# EAGLE board 2_1 (EAGLE 5.10)
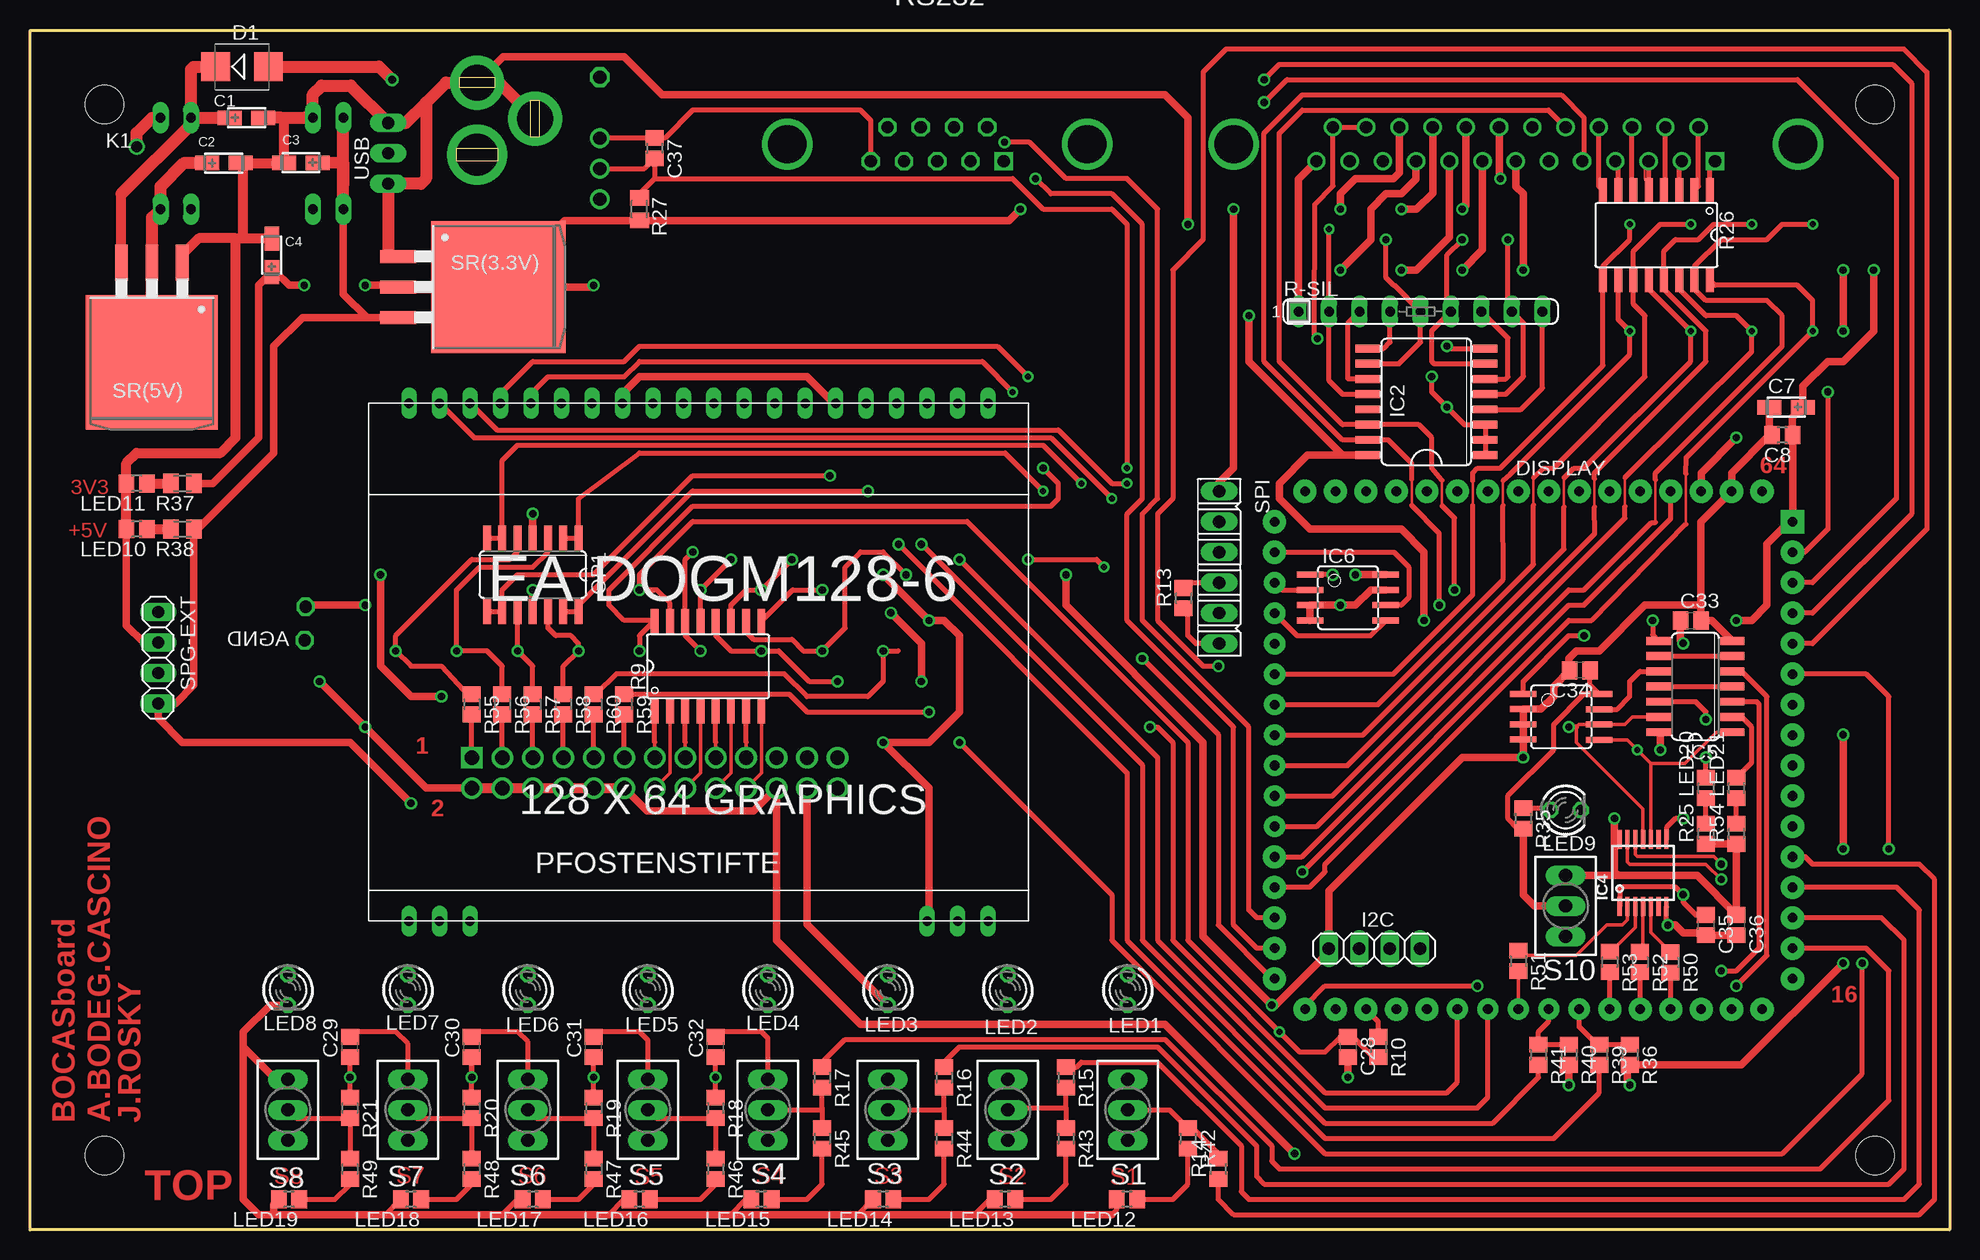
[diagram p2: board, top side]
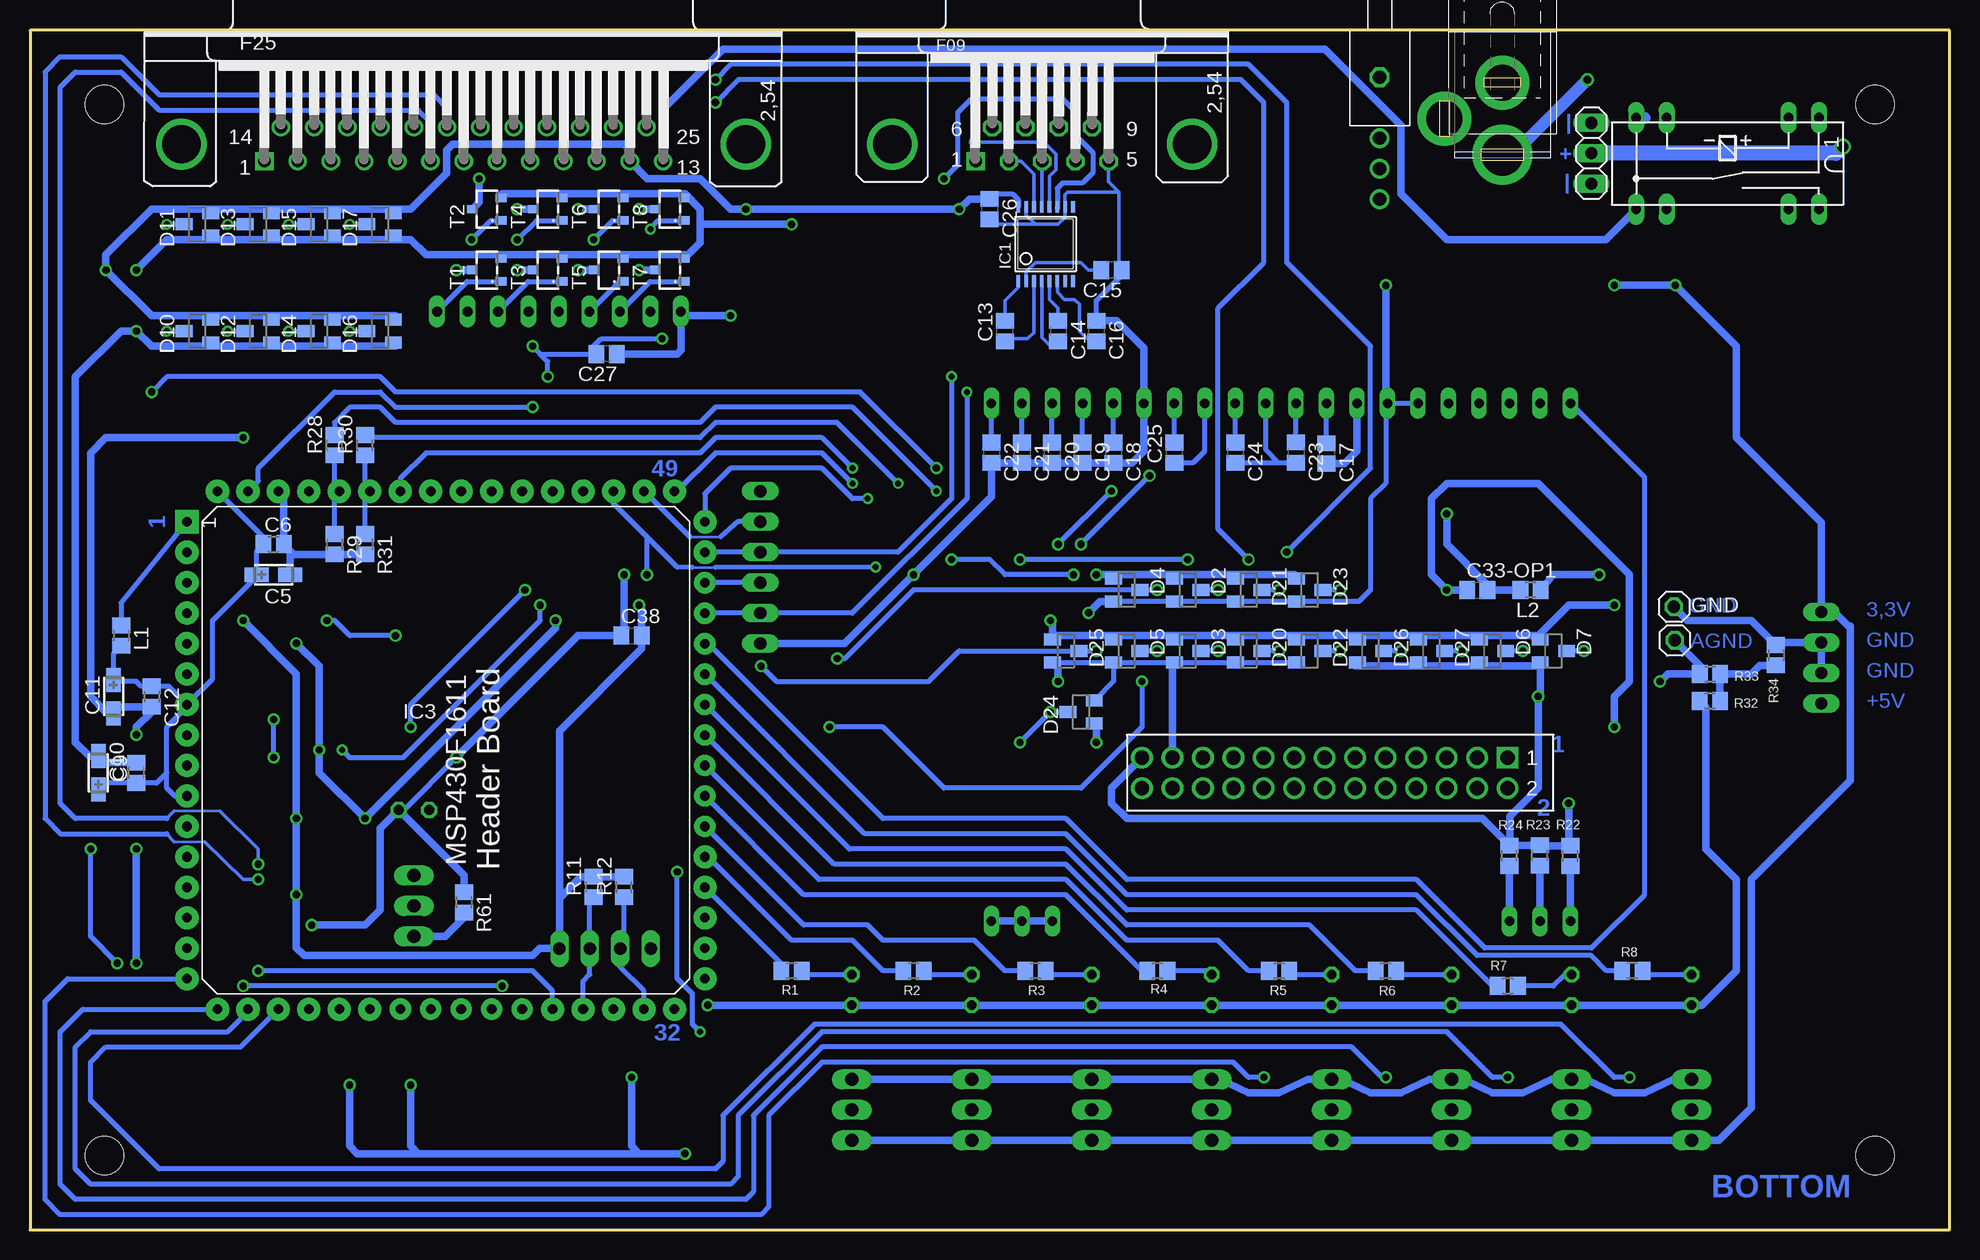
[diagram p3: board, bottom side, seen from below]

Size 160 x 100.02 mm. Coordinates in mm from the lower left corner, seen from the top.
Outline: 160,100 0,100
Outline: 0,100 0,0 160,0 160,100
Outline: 0,100 159.97,100.02 160,100
Copper layers (1*16): Top 0.035mm / dielectric 1.5mm / Bottom 0.035mm
Design rules "default *": minimum track width 6mil, minimum drill 12mil, track to track 8mil, track to pad 8mil, pad to pad 8mil, via to via 8mil, smd to smd 8mil, copper to edge 20mil, drill to drill 8mil, minimum pad ring 10mil, minimum via ring 8mil, stop-mask expansion 4mil, vias tented up to drill 0mil, thermal gap 10mil
Net classes: 1 Power: width 0.61 mm, drill 0.406 mm, clearance 0.203 mm; 2 High Strom: width 0.61 mm, drill 0.508 mm, clearance 0.203 mm; 3 Digital: width 0.152 mm, drill 0.305 mm, clearance 0.152 mm; 4 Analog: width 0.406 mm, drill 0.305 mm, clearance 0.203 mm; 5 VCC +3.3V: width 0.406 mm, drill 0.305 mm, clearance 0.203 mm
Holes 3.2 mm at 6.2,93.8 6.2,6.2 153.8,6.2 153.8,93.8

## Footprints (pad centres in the part's own frame; a part is rotated, then mirrored left to right if it is on the bottom)
1X01 = drill 1.016 octagon: 1 0,0
CT3216 = smd 2 x 1.2: + 1.4,0; - -1.4,0
R0805 = smd 1.3 x 1.5: 1 -0.85,0; 2 0.85,0
C0805 = smd 1.3 x 1.5: 1 -0.85,0; 2 0.85,0
SMB = smd 2.4 x 2.4: A 2.2,0; C -2.2,0
SOT23 = smd 1 x 1.4: 1 -0.95,-1.1; 2 0.95,-1.1; 3 0,1.1
F25-HORIZONTAL_2 = drill 1.016 square: 1 16.62,10.92 | drill 1.016 round: 2 13.85,10.92; 3 11.08,10.92; 4 8.31,10.92; 5 5.54,10.92; 6 2.77,10.92; 7 0,10.92; 8 -2.77,10.92; 9 -5.54,10.92; 10 -8.31,10.92; 11 -11.08,10.92; 12 -13.85,10.92; 13 -16.62,10.92; 14 15.235,8.08; 15 12.465,8.08; 16 9.695,8.08; 17 6.925,8.08; 18 4.155,8.08; 19 1.385,8.08; 20 -1.385,8.08; 21 -4.155,8.08; 22 -6.925,8.08; 23 -9.695,8.08; 24 -12.465,8.08; 25 -15.235,8.08 | drill 3.2 round: P$1 -23.52,9.5; P$2 23.52,9.5
EADOGM128 = drill 0.8 long: 1 -24.13,-21.59; 2 -21.59,-21.59; 3 -19.05,-21.59; 18 19.05,-21.59; 19 21.59,-21.59; 20 24.13,-21.59; 21 24.13,21.59; 22 21.59,21.59; 23 19.05,21.59; 24 16.51,21.59; 25 13.97,21.59; 26 11.43,21.59; 27 8.89,21.59; 28 6.35,21.59; 29 3.81,21.59; 30 1.27,21.59; 31 -1.27,21.59; 32 -3.81,21.59; 33 -6.35,21.59; 34 -8.89,21.59; 35 -11.43,21.59; 36 -13.97,21.59; 37 -16.51,21.59; 38 -19.05,21.59; 39 -21.59,21.59; 40 -24.13,21.59
1X04 = drill 1.016 long: 1 -3.81,0; 2 -1.27,0; 3 1.27,0; 4 3.81,0
TSSOP16 = smd 0.305 x 0.991: 1 -2.275,-3.1; 2 -1.625,-3.1; 3 -0.975,-3.1; 4 -0.325,-3.1; 5 0.325,-3.1; 6 0.975,-3.1; 7 1.625,-3.1; 8 2.275,-3.1; 9 2.275,3.1; 10 1.625,3.1; 11 0.975,3.1; 12 0.325,3.1; 13 -0.325,3.1; 14 -0.975,3.1; 15 -1.625,3.1; 16 -2.275,3.1
SO16L = smd 0.66 x 2.032: 1 -4.445,-4.902; 2 -3.175,-4.902; 3 -1.905,-4.902; 4 -0.635,-4.902; 5 0.635,-4.902; 6 1.905,-4.902; 7 3.175,-4.902; 8 4.445,-4.902; 9 4.445,4.902; 10 3.175,4.902; 11 1.905,4.902; 12 0.635,4.902; 13 -0.635,4.902; 14 -1.905,4.902; 15 -3.175,4.902; 16 -4.445,4.902
SOIC8 = smd 0.5 x 2.2: 1 -1.905,-3.154; 2 -0.645,-3.154; 3 0.625,-3.154; 4 1.895,-3.154; 5 1.905,3.154; 6 0.635,3.154; 7 -0.635,3.154; 8 -1.905,3.154
TSSOP14 = smd 0.35 x 1.6: 1 -1.95,-2.8; 2 -1.3,-2.8; 3 -0.65,-2.8; 4 0,-2.8; 5 0.65,-2.8; 6 1.3,-2.8; 7 1.95,-2.8; 8 1.95,2.8; 9 1.3,2.8; 10 0.65,2.8; 11 0,2.8; 12 -0.65,2.8; 13 -1.3,2.8; 14 -1.95,2.8
SO14 = smd 0.66 x 2.032: 1 -3.81,-3.073; 2 -2.54,-3.073; 3 -1.27,-3.073; 4 0,-3.073; 5 1.27,-3.073; 6 2.54,-3.073; 7 3.81,-3.073; 8 3.81,3.073; 9 2.54,3.073; 10 1.27,3.073; 11 0,3.073; 12 -1.27,3.073; 13 -2.54,3.073; 14 -3.81,3.073
RR1U = drill 0.813 long: 1 -7.62,-3.81; 2 -5.08,-3.81; 6 5.08,-3.81; 7 7.62,-3.81; 8 7.62,3.81; 9 5.08,3.81; 13 -5.08,3.81; 14 -7.62,3.81
LED3MM = drill 0.813 octagon: A -1.27,0; K 1.27,0
ML26 = drill 1.2 square: 1 -15.24,-1.27 | drill 1.2 round: 2 -15.24,1.27; 3 -12.7,-1.27; 4 -12.7,1.27; 5 -10.16,-1.27; 6 -10.16,1.27; 7 -7.62,-1.27; 8 -7.62,1.27; 9 -5.08,-1.27; 10 -5.08,1.27; 11 -2.54,-1.27; 12 -2.54,1.27; 13 0,-1.27; 14 0,1.27; 15 2.54,-1.27; 16 2.54,1.27; 17 5.08,-1.27; 18 5.08,1.27; 19 7.62,-1.27; 20 7.62,1.27; 21 10.16,-1.27; 22 10.16,1.27; 23 12.7,-1.27; 24 12.7,1.27; 25 15.24,-1.27; 26 15.24,1.27
SO16-F = smd 0.66 x 2.032: 1 -4.445,-3.748; 2 -3.175,-3.748; 3 -1.905,-3.748; 4 -0.635,-3.748; 5 0.635,-3.748; 6 1.905,-3.748; 7 3.175,-3.748; 8 4.445,-3.748; 9 4.445,3.748; 10 3.175,3.748; 11 1.905,3.748; 12 0.635,3.748; 13 -0.635,3.748; 14 -1.905,3.748; 15 -3.175,3.748; 16 -4.445,3.748
M0805 = smd 1.3 x 1.6: 1 -0.95,0; 2 0.95,0
SIL9 = drill 0.813 long: 1 -10.16,0; 2 -7.62,0; 3 -5.08,0; 4 -2.54,0; 5 0,0; 6 2.54,0; 7 5.08,0; 8 7.62,0; 9 10.16,0
F09-H1 = drill 1.016 square: 1 5.54,10.92 | drill 1.016 octagon: 2 2.77,10.92; 3 0,10.92; 4 -2.77,10.92; 5 -5.54,10.92; 6 4.155,8.08; 7 1.385,8.08; 8 -1.385,8.08; 9 -4.155,8.08 | drill 3.2 round: P$1 -12.495,9.5; P$2 12.495,9.5
2MS = drill 1.1 pad 1.422 long: 1 -2.54,0; 2 0,0; 3 2.54,0
KIPPTASTER-90 = drill 1.1 round: P1 0,2.54; P2 0,5.08; P3 0,7.62 | drill 1.1 octagon: P$4 0,-2.54
PFOSTENSTECKER-P06 = drill 1.016 long: 1 -6.35,0; 2 -3.81,0; 3 -1.27,0; 4 1.27,0; 5 3.81,0; 6 6.35,0
TO263-3 = smd 1.067 x 3: 1 -2.54,-5.791; 2 0,-5.791; 3 2.54,-5.791 | smd 11 x 11.2: TAB 0,2.54
SOT346 = smd 0.7 x 0.9: 1 -0.95,-1.2; 2 0.95,-1.2; 3 0,1.2
MCKU = drill 0.8 pad 1.93 square: 1 -22.86,-20.32 | drill 0.8 pad 1.93 round: 2 -20.32,-20.32; 3 -17.78,-20.32; 4 -15.24,-20.32; 5 -12.7,-20.32; 6 -10.16,-20.32; 7 -7.62,-20.32; 8 -5.08,-20.32; 9 -2.54,-20.32; 10 0,-20.32; 11 2.54,-20.32; 12 5.08,-20.32; 13 7.62,-20.32; 14 10.16,-20.32; 15 12.7,-20.32; 16 15.24,-20.32; 17 17.78,-17.78; 18 17.78,-15.24; 19 17.78,-12.7; 20 17.78,-10.16; 21 17.78,-7.62; 22 17.78,-5.08; 28 17.78,10.16; 29 17.78,12.7; 30 17.78,15.24; 31 17.78,17.78; 32 17.78,20.32; 33 15.24,22.86; 34 12.7,22.86; 35 10.16,22.86; 36 7.62,22.86; 37 5.08,22.86; 47 -20.32,22.86; 48 -22.86,22.86; 49 -25.4,20.32; 50 -25.4,17.78; 51 -25.4,15.24; 52 -25.4,12.7; 53 -25.4,10.16; 54 -25.4,7.62; 55 -25.4,5.08; 56 -25.4,2.54; 57 -25.4,0; 58 -25.4,-2.54; 59 -25.4,-5.08; 60 -25.4,-7.62; 61 -25.4,-10.16; 62 -25.4,-12.7; 63 -25.4,-15.24; 64 -25.4,-17.78 | drill 0.8 pad 1.778 round: 23 17.78,-2.54; 24 17.78,0; 25 17.78,2.54; 26 17.78,5.08; 27 17.78,7.62; 38 2.54,22.86; 39 0,22.86; 40 -2.54,22.86; 41 -5.08,22.86; 42 -7.62,22.86; 43 -10.16,22.86; 44 -12.7,22.86; 45 -15.24,22.86; 46 -17.78,22.86
1X03 = drill 1.016 long: 1 -2.54,0; 2 0,0; 3 2.54,0
VCC-BUCHSE-MULTIOCOMP = drill 3 pad 4.5 round: 1 0,-4.8; 2 -3,0 | drill 3.5 pad 5 round: 3 3,0

## Placement (x,y rotation side)
AGND  [1X01]  22.9,49.15 0 bottom
C1  10uF  [CT3216]  18.06,92.7 180 top
C2  10uF  [CT3216]  16.16,88.93 180 top
C3  10uF  [CT3216]  22.58,88.95 0 top
C4  10uF  [CT3216]  20.15,81.25 270 top
C5  10uF  [CT3216]  139.7,54.61 180 bottom
C6  100nF  [R0805]  139.7,57.15 0 bottom
C7  10uF  [CT3216]  146.39,68.58 0 top
C8  100nF  [R0805]  146.06,66.26 180 top
C9  10uF  [CT3216]  154.31,38.1 270 bottom
C10  100nF  [R0805]  151.13,38.1 90 bottom
C11  10uF  [CT3216]  153.03,44.45 90 bottom
C12  100nF  [R0805]  149.86,44.45 270 bottom
C13  100nF  [C0805]  78.74,74.93 90 bottom
C14  100nF  [C0805]  74.3,74.93 270 bottom
C15  100nF  [C0805]  69.85,80.01 180 bottom
C16  100nF  [C0805]  71.12,74.93 270 bottom
C17  1uF  [C0805]  51.92,64.73 270 bottom
C18  1uF  [C0805]  69.69,64.78 270 bottom
C19  1uF  [C0805]  72.28,64.78 270 bottom
C20  1uF  [C0805]  74.8,64.78 270 bottom
C21  1uF  [C0805]  77.32,64.78 270 bottom
C22  1uF  [C0805]  79.86,64.78 270 bottom
C23  1uF  [C0805]  54.49,64.78 270 bottom
C24  1uF  [C0805]  59.54,64.78 270 bottom
C25  1uF  [C0805]  64.61,64.78 90 bottom
C26  100nF  [C0805]  80.01,85.09 270 bottom
C27  100nF  [C0805]  111.93,73.02 180 bottom
C28  100nF  [C0805]  109.86,15.24 270 top
C29  1uF  [C0805]  26.67,15.24 90 top
C30  1uF  [C0805]  36.83,15.24 90 top
C31  1uF  [C0805]  46.99,15.24 90 top
C32  1uF  [C0805]  57.15,15.24 90 top
C33  100nF  [C0805]  138.43,50.8 0 top
C33-OP1  100nF  [C0805]  39.37,53.34 0 bottom
C34  100nF  [C0805]  129.18,46.64 180 top
C35  100nF  [C0805]  139.7,25.4 270 top
C36  100nF  [C0805]  142.24,25.4 270 top
C37  100nF  [R0805]  52.07,90.17 270 top
C38  100nF  [C0805]  109.86,49.53 0 bottom
D1  [SMB]  17.68,96.97 0 top
D2  BAS40-04  [SOT23]  63.5,53.34 270 bottom
D3  BAS40-04  [SOT23]  63.5,48.26 270 bottom
D4  BAS40-04  [SOT23]  68.58,53.34 270 bottom
D5  BAS40-04  [SOT23]  68.58,48.26 270 bottom
D6  BAS40-04  [SOT23]  38.1,48.26 270 bottom
D7  BAS40-04  [SOT23]  33.02,48.26 270 bottom
D10  [SOT23]  146.05,74.93 90 bottom
D11  [SOT23]  146.05,83.82 90 bottom
D12  [SOT23]  140.97,74.93 90 bottom
D13  [SOT23]  140.97,83.82 90 bottom
D14  [SOT23]  135.89,74.93 90 bottom
D15  [SOT23]  135.89,83.82 90 bottom
D16  [SOT23]  130.81,74.93 90 bottom
D17  [SOT23]  130.81,83.82 90 bottom
D20  [SOT23]  58.42,48.26 270 bottom
D21  BAS40-04  [SOT23]  58.42,53.34 270 bottom
D22  [SOT23]  53.34,48.26 270 bottom
D23  [SOT23]  53.34,53.34 270 bottom
D24  BAS40-04  [SOT23]  72.39,43.18 90 bottom
D25  BAS40-04  [SOT23]  73.66,48.26 270 bottom
D26  BAS40-04  [SOT23]  48.26,48.26 270 bottom
D27  BAS40-04  [SOT23]  43.18,48.26 270 bottom
D-SUB-25  [F25-HORIZONTAL_2]  123.84,100 180 bottom
DISPLAY  EADOGM128  [EADOGM128]  55.73,47.32 0 top
GND  [1X01]  22.97,51.94 0 bottom
I2C  [1X04]  112.06,23.45 180 top
IC1  MAX3232IPW  [TSSOP16]  75.34,82.18 0 bottom
IC2  PCF8574AT  [SO16L]  116.4,69.03 90 top
IC3  AT24C02BN-SHB  [SOIC8]  127.63,42.76 270 top
IC4  TX0104E  [TSSOP14]  134.45,29.75 0 top
IC5  74HC04D  [SO14]  138.82,45.29 90 top
IC6  FM25CL64B  [SOIC8]  109.86,52.7 270 top
K1  DIP05-1C90-51D  [RR1U]  18.5,88.9 180 bottom
L1  10µ?  [R0805]  152.4,49.53 270 bottom
L2  10µ?  [R0805]  34.92,53.34 180 bottom
LED1  1.7V  [LED3MM]  91.5,20 270 top
LED2  1.7V  [LED3MM]  81.5,20 270 top
LED3  1.7V  [LED3MM]  71.5,20 270 top
LED4  1.7V  [LED3MM]  61.5,20 270 top
LED5  1.7V  [LED3MM]  51.5,20 270 top
LED6  1.7V  [LED3MM]  41.5,20 270 top
LED7  1.7V  [LED3MM]  31.5,20 270 top
LED8  1.7V  [LED3MM]  21.5,20 270 top
LED9  1.7V  [LED3MM]  128,35 0 top
LED10  [R0805]  8.89,58.42 180 top
LED11  [R0805]  8.89,62.23 180 top
LED12  [R0805]  91.44,2.54 180 top
LED13  [R0805]  81.28,2.54 180 top
LED14  [R0805]  71.12,2.54 180 top
LED15  [R0805]  60.96,2.54 180 top
LED16  [R0805]  50.8,2.54 180 top
LED17  [R0805]  41.91,2.54 180 top
LED18  [R0805]  31.75,2.54 180 top
LED19  [R0805]  21.59,2.54 180 top
LED20  [R0805]  139.7,36.83 90 top
LED21  [R0805]  142.24,36.83 90 top
OP1  MCP6054SOIC14  [SO14]  41.91,54.61 180 top
PFOSTENSTIFTE  D-Sub-25pol-2  [ML26]  52.07,38.1 180 bottom
R1  750R  [R0805]  96.52,21.59 180 bottom
R2  750R  [R0805]  86.36,21.59 180 bottom
R3  750R  [R0805]  76.2,21.59 180 bottom
R4  750R  [R0805]  66.04,21.59 180 bottom
R5  750R  [R0805]  55.88,21.59 180 bottom
R6  750R  [R0805]  46.99,21.59 180 bottom
R7  750R  [R0805]  36.83,20.32 180 bottom
R8  750R  [R0805]  26.44,21.6 180 bottom
R9  1k  [SO16-F]  56.51,46.99 0 top
R10  1k6  [R0805]  112.39,15.24 270 top
R11  2k2  [R0805]  113.03,28.57 90 bottom
R12  2k2  [R0805]  110.49,28.57 90 bottom
R13  100k  [R0805]  96.16,52.65 90 top
R14  1K  [R0805]  99.06,5.08 90 top
R15  1K  [R0805]  86.36,12.7 270 top
R16  1K  [R0805]  76.2,12.7 270 top
R17  1K  [R0805]  66.04,12.7 270 top
R18  1K  [R0805]  57.15,10.16 270 top
R19  1K  [R0805]  46.99,10.16 270 top
R20  1K  [R0805]  36.83,10.16 270 top
R21  1K  [R0805]  26.67,10.16 270 top
R22  0.1k  [R0805]  31.61,31.16 90 bottom
R23  0.1k  [R0805]  34.16,31.21 90 bottom
R24  0.1k  [R0805]  36.69,31.19 90 bottom
R25  1K5  [R0805]  139.7,33.02 90 top
R26  1k  [SO16-F]  135.57,82.92 180 top
R27  68K  [M0805]  50.8,85.09 270 top
R28  10K 1%  [R0805]  134.62,65.41 90 bottom
R29  10K 1%  [R0805]  134.62,57.15 270 bottom
R30  10K 1%  [R0805]  132.08,65.41 90 bottom
R31  10K 1%  [R0805]  132.08,57.15 270 bottom
R32  0k  [R0805]  19.98,44.1 0 bottom
R33  0k  [R0805]  19.96,46.33 0 bottom
R34  0k  [R0805]  14.46,47.9 270 bottom
R35  1K5  [R0805]  124.46,34.29 270 top
R36  10K 1%  [R0805]  133.35,14.61 270 top
R37  750R  [M0805]  12.7,62.23 180 top
R38  1K5  [M0805]  12.7,58.42 180 top
R39  10K 1%  [R0805]  130.81,14.61 270 top
R40  10K 1%  [R0805]  128.27,14.61 270 top
R41  10K 1%  [R0805]  125.73,14.61 270 top
R42  750R  [R0805]  96.52,7.62 270 top
R43  750R  [R0805]  86.36,7.62 270 top
R44  750R  [R0805]  76.2,7.62 270 top
R45  750R  [R0805]  66.04,7.62 270 top
R46  750R  [R0805]  57.15,5.08 270 top
R47  750R  [R0805]  46.99,5.08 270 top
R48  750R  [R0805]  36.83,5.08 270 top
R49  750R  [R0805]  26.67,5.08 270 top
R50  470R  [R0805]  136.75,22.3 270 top
R51  470R  [R0805]  124.06,22.41 270 top
R52  470R  [R0805]  134.21,22.32 270 top
R53  470R  [R0805]  131.67,22.33 270 top
R54  1K5  [R0805]  142.24,33.02 90 top
R55  1K  [R0805]  36.83,43.81 270 top
R56  1K  [R0805]  39.37,43.81 270 top
R57  1K  [R0805]  41.91,43.81 270 top
R58  1K  [R0805]  44.45,43.81 270 top
R59  100R  [R0805]  49.53,43.81 270 top
R60  100R  [R0805]  46.99,43.81 270 top
R61  0k  [R0805]  123.83,27.3 270 bottom
R-SIL  3k3  [SIL9]  115.91,76.56 0 top
RS232  [F09-H1]  75.63,100 180 bottom
S1  [2MS]  91.5,10 270 top
S2  [2MS]  81.5,10 270 top
S3  [2MS]  71.5,10 270 top
S4  [2MS]  61.5,10 270 top
S5  [2MS]  51.5,10 270 top
S6  [2MS]  41.5,10 270 top
S7  [2MS]  31.5,10 270 top
S8  [2MS]  21.5,10 270 top
S10  [2MS]  128,27 270 top
S11  RESET-KIPPTASTER  [KIPPTASTER-90]  47.5,93.55 180 bottom
SPG-EXT  [1X04]  10.68,47.69 270 top
SPI  [PFOSTENSTECKER-P06]  99.12,55.22 270 top
SR(3.3V)  LM1086-3.3V  [TO263-3]  36.49,78.59 270 top
SR(5V)  LM1086-5V  [TO263-3]  10.16,74.84 180 top
T1  [SOT346]  121.92,80.01 90 bottom
T2  [SOT346]  121.92,85.09 90 bottom
T3  [SOT346]  116.84,80.01 90 bottom
T4  [SOT346]  116.84,85.09 90 bottom
T5  [SOT346]  111.76,80.01 90 bottom
T6  [SOT346]  111.76,85.09 90 bottom
T7  [SOT346]  106.68,80.01 90 bottom
T8  [SOT346]  106.68,85.09 90 bottom
U$1  HEADER_BOARD_2  [MCKU]  126.6,36.17 270 bottom
USB  [1X03]  29.85,89.74 270 bottom
VCC-BUCHSE  [VCC-BUCHSE-MULTIOCOMP]  37.29,92.64 270 bottom

## Tracks (layer width: path | path; a pad name or v marks a point on that pad's centre or on a via)
+3V3  (via drill 0.6)
  Top 0.406: IC4.1 132.5,28.36 132.72,28.57 137.16,28.57 v137.79,27.94 137.79,27.3 138.85,26.25 C35.1 | IC4.8 136.4,33.53 137.16,34.29 v137.79,34.29 | C8.1 146.92,66.24 | U$1.1 146.66,59.03 | IC6.3
  Top 0.61: SR(3.3V).TAB 44.57,84.14 R27.2 81.6,84.14 v82.55,85.09 | v153.67,80.01 153.67,74.93 151.13,72.39 149.86,72.39 147.79,70.32 C7.+ 146.91,67.7 C8.1 | v22.86,78.74 21.59,78.74 20.48,79.84 C4.+ 19.05,78.75 19.05,66.04 15.24,62.23 R37.1 | v27.94,78.74 30.55,78.74 SR(3.3V).2 | SPI.1 99.12,62.29 100.33,63.5 v100.33,85.09 | 146.92,66.24 U$1.1 | 146.66,59.03 144.78,57.15 144.78,52.07 143.51,50.8 v142.24,50.8 | v71.75,51.44 74.3,48.9 v74.3,45.72 | 36.83,78.59 46.84,78.59 v46.99,78.74 | IC6.7 111.76,53.34 110.49,52.07 v109.22,52.07 IC6.3 | IC6.3 IC6.4
  Top 1.016: SR(3.3V).2 36.83,78.59 SR(3.3V).TAB
  Bottom 0.406: D22.2 D20.2 D3.2 | D5.2 D3.2 | D4.2 D2.2 D21.2 D23.2 49.21,52.39 48.26,53.34 48.26,60.96 46.99,62.23 46.99,68.76 DISPLAY.34 DISPLAY.35 | D25.2 D5.2 | L1.1 152.4,52.28 U$1.1 | IC1.16 77.62,85.87 78.11,86.36 79.59,86.36 C26.1 | D5.2 69.68,45.74 D24.2 | D3.2 64.77,47.14 | 109,51.85 v109.22,52.07
  Bottom 0.61: S1.3 S2.3 S3.3 S4.3 S5.3 S6.3 S7.3 S8.3 19.21,7.46 16.51,10.16 16.51,29.21 8.26,37.47 8.26,50.34 8.43,50.34 9.59,51.5 SPG-EXT.1 10.68,58.94 17.78,66.04 17.78,73.66 v22.86,78.74 v27.94,78.74 | R12.2 R11.2 114.08,29.43 115.87,27.64 | 115.87,27.64 I2C.1 117.52,23.45 118.11,22.86 137.16,22.86 137.79,23.5 v137.79,27.94 v137.79,34.29 137.79,46.35 v142.24,50.8 | C26.1 81.7,85.94 v82.55,85.09 v100.33,85.09 101.6,85.09 104.14,87.63 108.54,87.63 D-SUB-25.12 109.99,89.99 110.49,90.49 124.78,90.49 125.25,90.01 125.25,88.11 128.27,85.09 129.54,85.09 | 64.77,47.14 PFOSTENSTIFTE.23 | D4.2 70.8,52.39 v71.75,51.44 | v74.3,45.72 74.3,46.84 D25.2 | v46.99,78.74 46.99,69.06 DISPLAY.34 | 115.87,27.64 115.87,41.61 109,48.48 C38.2 109,51.85 | 145.27,85.09 149.86,85.09 153.67,81.28 v153.67,80.01 149.86,76.2 144.78,76.2 | 145.27,85.09 D11.2 | 145.27,85.09 139.7,85.09 139.87,84.92 D13.2 139.55,85.09 134.62,85.09 | 134.62,85.09 134.79,84.92 D15.2 134.62,84.94 134.62,85.09 | D17.2 129.71,84.92 129.54,85.09 | 129.54,85.09 134.62,85.09 | D16.2 129.71,76.03 129.54,76.2 134.47,76.2 | 134.47,76.2 D14.2 | 139.7,76.2 139.87,76.03 D12.2 139.7,76.05 139.7,76.2 | 139.7,76.2 134.47,76.2 | 144.78,76.2 139.7,76.2 | D10.2 144.95,76.03 144.78,76.2
+5V  (via drill 0.6)
  Top 0.305: IC4.14 132.5,32.6 132.08,33.02
  Top 0.61: K1.8 26.12,78.02 28.09,76.05 | 28.09,76.05 SR(3.3V).3 | R25.1 R54.1 C36.1 138.96,29.53 132.72,29.53 | R-SIL.1 105.75,87.6 D-SUB-25.13 | 28.09,76.05 22.71,76.05 20.32,73.66 20.32,64.77 13.97,58.42 R38.1 13.65,45.4 12.13,43.88 SPG-EXT.4 10.68,42.66 12.7,40.64 26.67,40.64 v31.75,35.56 | v101.6,76.2 101.6,72.39 109.4,64.59 IC2.16 106.5,64.59 104.14,62.23 104.14,60.96 106.68,58.42 114.3,58.42 116.2,56.52 v116.2,50.8 | v29.21,54.61 29.21,46.99 31.75,44.45 v34.29,44.45 | v132.08,34.29 132.08,33.02 132.08,29.84 132.4,29.53 132.72,29.53 | C33.1 137.58,49.11 v137.79,48.9 | v135.89,40.01 135.89,41.34 IC5.14 | S10.1 132.7,29.54 132.72,29.53
  Top 1.016: K1.7 K1.8 26.13,88.9 C3.+
  Bottom 0.61: C27.1 106.05,73.02 105.75,73.32 R-SIL.1 105.39,76.2 v101.6,76.2 | 36.66,32.06 36.66,34.46 34.29,36.83 v34.29,44.45 34.12,44.62 34.12,46.82 34.29,46.99 34.29,47.14 D7.2 34.44,46.99 39.37,46.99 | v31.75,35.56 31.75,32.15 R22.2 34.11,32.01 R23.2 36.66,32.06 | v116.2,50.8 116.2,50.16 v132.08,34.29 135.89,38.1 v135.89,40.01 135.89,46.99 v137.79,48.9 | v29.21,54.61 33.02,54.61 L2.1 | PFOSTENSTIFTE.25 69.85,36.83 69.85,35.56 68.58,34.29 38.94,34.29 R24.2 36.66,32.06 | D-SUB-25.13 107.22,93.44 102.23,98.42 52.07,98.42 45.72,92.08 45.72,86.36 41.91,82.55 28.66,82.55 K1.8 | D6.2 39.2,47.16 39.37,46.99 | 39.37,46.99 44.45,46.99 44.45,47.14 D27.2 44.6,46.99 49.53,46.99 49.36,47.16 D26.2
  Bottom 1.016: K1.7 25.4,92.71
A0  (via drill 0.6)
  Top 0.406: OP1.5 40.64,56.52 40.01,55.88 36.83,55.88 30.48,49.53 v30.48,48.26 31.75,46.99 34.29,46.99 36.62,44.45 R55.1
  Bottom 0.406: v30.48,48.26 D7.3
A0#
  Top 0.406: PFOSTENSTIFTE.1 R55.2
A1  (via drill 0.6)
  Top 0.406: R56.1 39.37,46.99 38.1,48.26 v35.56,48.26 35.56,53.34 37.47,55.24 41.91,55.24 43.18,56.52 OP1.3
  Bottom 0.406: v35.56,48.26 D6.3
A1#
  Top 0.406: PFOSTENSTIFTE.3 R56.2
A2_TX
  Top 0.305: 133.8,23.58 R52.1 134.45,23.42 IC4.4
A3_TX
  Top 0.305: IC4.3 133.8,25.22 131.76,23.18 R53.1
A4_TX
  Top 0.305: R51.1 124.46,22.86 128.91,22.86 131.44,25.4 132.72,25.4 133.15,25.84 IC4.2
ADC0
  Bottom 0.406: R30.1 132.08,61.97 U$1.59 132.08,61.17 R31.1
ADC1
  Bottom 0.406: R28.1 134.62,61.97 U$1.60 134.62,61.17 R29.1
ADC2  (via drill 0.5, 0.6)
  Top 0.406: v50.8,53.34 52.07,53.34 | U$1.61 136.76,59.29 129.54,52.07 128.27,52.07 v106.05,29.84 | R10.2 112.18,14.61 111.76,14.61 110.28,16.09 C28.1 109.22,16.09 107.95,14.82 105.83,14.82 v104.14,16.51 96.52,24.13 96.52,40.64 78.11,59.05 55.24,59.05 50.8,54.61 v50.8,53.34 | R9.15 53.34,52.24 D23.3 v50.8,53.34
  Bottom 0.406: v50.8,53.34 D23.3 | v106.05,29.84 106.05,20.95 104.78,19.68 104.78,17.14 v104.14,16.51
ADC3  (via drill 0.6)
  Top 0.406: 52.07,50.8 50.8,49.53 v50.8,48.26 | R9.16 52.01,50.8 49.53,50.8 48.26,52.07 48.26,53.34 55.24,60.33 85.09,60.33 85.72,60.96 85.72,62.23 v84.45,63.5 | U$1.2 147.93,56.49 149.86,58.42 v149.86,69.85
  Top 0.61: R9.16 52.07,50.8
  Bottom 0.406: v50.8,48.26 D22.3 | v149.86,69.85 148.59,71.12 130.81,71.12 129.54,69.85 90.81,69.85 v84.45,63.5
ADC4  (via drill 0.6)
  Top 0.406: R9.13 v55.88,53.34 v58.42,55.88 | U$1.3 148.56,53.95 155.57,60.96 155.57,87.63 147.32,95.89 104.78,95.89 v102.87,93.98
  Bottom 0.406: v55.88,53.34 D21.3 | v102.87,93.98 100.97,95.89 59.05,95.89 57.15,93.98 57.15,80.64 60.96,76.83 60.96,58.42 v58.42,55.88
ADC5  (via drill 0.6)
  Top 0.406: v55.88,48.26 54.61,49.53 R9.14 54.61,55.88 v55.24,56.52 | U$1.4 148.56,51.41 156.84,59.69 156.84,95.57 155.26,97.16 104.14,97.16 v102.87,95.89
  Bottom 0.406: v55.88,48.26 D20.3 | v102.87,95.89 101.6,97.16 58.42,97.16 55.24,93.98 55.24,80.64 48.26,73.66 48.26,63.5 v55.24,56.52
AGND  (via drill 0.6)
  Top 0.61: PFOSTENSTIFTE.12 51.44,34.92 60.33,34.92 PFOSTENSTIFTE.22 62.23,24.13 69.22,17.14 94.61,17.14 v105.41,6.35 | v41.91,53.34 OP1.11 | v151.13,22.23 142.66,13.76 R36.2 133.13,13.76 133.13,12.28 v133.35,12.06 | v151.13,31.75 v151.13,41.27 | PFOSTENSTIFTE.2 33.02,36.83 v27.94,41.91 v24.13,45.72 | U$1.62 139.3,63.1 v142.24,66.04 | v109.86,12.7 C28.2 | v128.27,12.06 R40.2
  Top 0.813: PFOSTENSTIFTE.2 PFOSTENSTIFTE.4 PFOSTENSTIFTE.6 PFOSTENSTIFTE.8 PFOSTENSTIFTE.10 PFOSTENSTIFTE.12
  Bottom 0.61: U$1.62 138.85,61.12 C6.2 138.3,56.6 | 138.3,56.6 C5.- | R31.2 R29.2 138,56.3 138.3,56.6 | v41.91,53.34 41.49,53.34 | v151.13,22.23 v151.13,31.75 | v24.13,45.72 23.5,46.35 23.47,46.33 R33.1 20.81,47.06 AGND.1 | v142.24,66.04 153.67,66.04 154.94,64.77 154.94,44.45 153.67,43.18 153.16,43.18 C11.- 152.49,43.6 C12.2 149.86,43.18 151.13,41.91 v151.13,41.27 | v41.91,53.34 C33-OP1.1 | v105.41,6.35 109.22,6.35 | 109.22,6.35 109.86,6.99 v109.86,12.7 | v128.27,12.06 128.27,6.99 127.64,6.35 | 109.22,6.35 127.64,6.35 | v133.35,12.06 133.35,6.99 132.72,6.35 127.64,6.35 | v41.91,53.34 43.18,54.61 43.18,60.96 41.91,62.23 34.29,62.23 26.67,54.61 26.67,45.72 27.94,44.45 v27.94,41.91
AVCC_MSP
  Bottom 0.406: U$1.64 140.55,57.74 C6.1 141.1,56.6 C5.+ 141.1,54.48 144.78,50.8 144.78,45.93 U$1.7 | U$1.7 146.92,43.58 148.59,41.91 148.59,38.1 | U$1.10 147.93,36.17 148.59,36.83 148.59,38.1 | 148.59,38.1 149.44,37.25 C10.1 153.75,37.25 C9.+ | U$1.7 148.43,45.3 C12.1 150.71,45.3 151.13,45.72 152.91,45.72 C11.+ 153.03,48.05 L1.2
BUS_IO_EXP_P.0
  Top 0.406: IC2.4 124.28,68.4 126.07,70.19 R-SIL.9
  Bottom 0.406: T1.1 123.56,79.06 R-SIL.9
BUS_IO_EXP_P.1  (via drill 0.6)
  Top 0.152: R-SIL.8 123.19,77.47
  Top 0.406: IC2.5 123.01,69.67 124.48,71.14 124.48,75.6 R-SIL.8 | 123.19,76.89 123.19,77.47 v123.19,82.55
  Bottom 0.406: T2.1 121.6,84.14 v123.19,82.55
BUS_IO_EXP_P.2
  Top 0.406: IC2.6 123.01,70.94 123.19,71.12 123.19,74.35 R-SIL.7
  Bottom 0.406: T3.1 118.48,79.06 R-SIL.7
BUS_IO_EXP_P.3  (via drill 0.6)
  Top 0.406: v119.38,82.55 118.11,81.28 118.11,76.89 R-SIL.6 116.84,74.95 116.84,72.39 117.02,72.21 IC2.7
  Bottom 0.406: T4.1 117.79,84.14 v119.38,82.55
BUS_IO_EXP_P.4
  Top 0.406: R-SIL.4 113.37,74 112.85,73.48 IC2.9
  Bottom 0.406: T5.1 110.86,79.06 R-SIL.4
BUS_IO_EXP_P.5  (via drill 0.6)
  Top 0.406: v113.03,82.55 113.03,79.38 113.67,78.74 113.72,78.74 R-SIL.5 115.91,74 114.12,72.21 IC2.10
  Bottom 0.406: T6.1 111.44,84.14 v113.03,82.55
BUS_IO_EXP_P.6
  Top 0.406: IC2.11 109.86,70.94 109.86,75.58 R-SIL.3
  Bottom 0.406: T7.1 108.32,79.06 R-SIL.3
BUS_IO_EXP_P.7  (via drill 0.5)
  Top 0.406: IC2.12 109.4,69.67 108.29,70.78 R-SIL.2 v108.29,83.42
  Bottom 0.406: v108.29,83.42 108.29,83.48 107.63,84.14 T8.1
C0  (via drill 0.6)
  Top 0.406: R57.1 41.91,46.99 v40.64,48.26 OP1.10
  Bottom 0.406: v40.64,48.26 D27.3
C0#
  Top 0.406: PFOSTENSTIFTE.5 R57.2
C1  (via drill 0.6)
  Top 0.406: R58.1 44.45,46.99 v45.72,48.26 45.72,48.9 45.09,49.53 43.81,49.53 43.18,50.16 OP1.12
  Bottom 0.406: v45.72,48.26 D26.3
C1#
  Top 0.406: PFOSTENSTIFTE.7 R58.2
C1+
  Bottom 0.305: IC1.1 77.62,78.59 78.74,77.47 C13.2
C1-
  Bottom 0.305: IC1.3 76.32,74.81 76.83,74.3 78.53,74.3 C13.1
C2+
  Bottom 0.305: IC1.4 75.67,74.4 74.93,73.66 74.72,73.66 C14.2
CA0
  Top 0.406: R36.1 R39.1 130.59,15.46 129.14,16.91 U$1.23
CA1
  Top 0.406: U$1.24 126.6,17.38 125.73,16.51 R41.1 R40.1
DAC0  (via drill 0.6)
  Top 0.406: R60.1 47.2,44.66 48.9,46.35 62.87,46.35 64.77,44.45 69.85,44.45 71.12,45.72 v71.12,48.26 72.39,48.26 | U$1.5 148.56,48.87 158.12,58.42 158.12,96.52 156.21,98.42 99.69,98.42 97.79,96.52 97.79,82.55 95.25,80.01 95.25,60.96 93.98,59.69 93.98,50.8 97.79,46.99 v99.06,46.99
  Bottom 0.406: v71.12,48.26 D25.3 82.55,48.26 85.09,45.72 97.79,45.72 v99.06,46.99
DAC0#
  Top 0.406: PFOSTENSTIFTE.9 R60.2
DAC1  (via drill 0.6)
  Top 0.406: R59.1 63.28,44.66 64.77,43.18 v74.93,43.18 | U$1.6 153.06,46.33 154.94,44.45 v154.94,31.75 | v152.72,22.23 152.72,13.02 146.05,6.35 107.95,6.35 90.17,24.13 90.17,27.94 v77.47,40.64
  Bottom 0.406: D24.3 v74.93,43.18 v77.47,40.64 | v154.94,31.75 154.94,24.45 v152.72,22.23
DAC1#
  Top 0.406: PFOSTENSTIFTE.11 R59.2
DGND  (via drill 0.6)
  Top 0.406: LED12.2 90.59,1.69 90.17,1.27 | 69,1.27 LED14.2 | LED13.2 80.01,2.54 78.74,1.27 | 29.63,1.27 LED18.2 | LED17.2 40.64,2.54 39.37,1.27 | LED16.2 49.53,2.54 48.26,1.27 | LED15.2 59.69,2.54 58.42,1.27 | S4.1 61.5,15.97 60.96,16.51 57.57,16.51 C32.2 | S5.1 51.5,15.81 50.8,16.51 47.41,16.51 C31.2 | S6.1 41.5,15.65 40.64,16.51 37.25,16.51 C30.2 | C29.2 26.67,16.51 30.48,16.51 31.5,15.49 S7.1 | IC2.1 IC2.2 IC2.3 119.56,67.13 v118.11,68.58 116.84,69.85 v116.84,71.12 | S11.P1 47.51,91.02 C37.1 52.92,91.02 55.24,93.34 69.22,93.34 70.09,92.47 RS232.5 | IC2.8 118.29,73.48 v118.11,73.66 | 124.46,40.85 IC3.4 | IC4.7 136.4,25.52 v136.53,25.4 | v107.31,74.3 107.08,74.59 107.09,85.48 108.61,87.02 D-SUB-25.25 D-SUB-25.24 | 139.49,24.77 C35.2 | 145,66.26 C8.2 | C7.- | v103.5,18.73 103.82,18.73 | 108.25,23.16 I2C.4 | C34.2 128.33,47.05 | SPI.6 97.18,48.87 96.52,49.53 96.52,51.45 R13.1
  Top 0.61: 90.17,1.27 78.74,1.27 69,1.27 58.42,1.27 48.26,1.27 39.37,1.27 29.63,1.27 20.32,1.27 | 20.32,1.27 20.32,2.12 LED19.2 | LED8.K 20,18.73 17.78,16.51 17.78,15.24 | 17.78,15.24 17.78,2.54 19.05,1.27 20.32,1.27 | S8.1 20.48,12.54 17.78,15.24 | C35.2 C36.2 | IC3.4 IC3.3 IC3.2 125.96,43.41 127,44.45 127,45.31 C34.2 128.27,46.7 128.27,47.62 128.91,48.26 130.81,48.26 134.62,52.07 139.28,52.07 | IC5.7 140.19,50.8 C33.2 139.28,52.07 | 124.46,40.85 v124.46,39.37 119.38,39.37 108.25,28.24 I2C.4 | v136.53,25.4 137.16,25.4 137.79,24.77 139.49,24.77 | 139.28,52.07 139.28,59.01 U$1.63 141.84,63.1 145,66.26 C7.- | PFOSTENSTIFTE.24 64.77,25.46 LED3.K | DISPLAY.26 66.97,68.92 64.77,71.12 50.8,71.12 49.38,69.7 DISPLAY.33 | v86.36,54.61 86.36,52.07 97.79,40.64 97.79,24.45 v103.5,18.73 | 103.82,18.73 108.25,23.16 | v110.49,54.61 IC6.8
  Bottom 0.305: 70.11,89.07 RS232.5 70.09,87.37 69.22,86.49 | IC1.15 76.96,85.1 76.96,84.58 76.2,83.82 | 73.06,86.49 73.52,86.49 73.72,86.29 73.72,85.1 IC1.10 73.72,84.4 74.3,83.82 76.2,83.82 | 73.06,86.49 73.07,86.49 | C16.1 70.9,76 | 69.22,86.49 73.06,86.49 | 69.22,86.49 69.22,80.22 C15.1 | 76.2,83.82 79.59,83.82 C26.2
  Bottom 0.406: LED9.K 128.83,35 v124.46,39.37 | v116.84,71.12 116.84,72.39 v118.11,73.66 117.47,73.02 C27.2 113.03,73.27 113.03,73.66 112.39,74.3 v107.31,74.3 | C15.1 69,79.59 71.12,77.47 C16.1 | U$1.63 140.97,62.44 140.97,63.5 134.62,69.85 130.81,69.85 129.54,68.58 v118.11,68.58 | C38.1 110.49,49.74
  Bottom 0.61: S1.1 S2.1 S3.1 S4.1 60.8,12.54 58.42,11.43 55.88,11.43 53.5,12.54 S5.1 50.64,12.54 48.26,11.43 45.72,11.43 43.34,12.54 S6.1 40.48,12.54 38.1,11.43 35.56,11.43 33.18,12.54 S7.1 30.32,12.54 27.94,11.43 25.4,11.43 23.02,12.54 S8.1 | C17.2 50.42,63.88 49.38,64.92 DISPLAY.33 | C16.1 69.43,75.78 67.16,73.51 DISPLAY.26 67.16,64.92 68.15,63.93 C18.2 C19.2 C20.2 C21.2 C22.2 79.86,61.11 v86.36,54.61 92.1,48.87 SPI.6 | R32.1 20.32,43.59 20.32,31.75 17.78,29.21 17.78,21.59 20.64,18.73 LED8.K LED7.K LED6.K LED5.K LED4.K LED3.K LED2.K LED1.K v103.5,18.73 | v136.53,25.4 132.08,25.4 130.81,26.67 130.81,33.46 LED9.K 123.83,29.55 R61.1 | v124.46,39.37 114.3,49.53 C38.1 | 110.49,49.74 v110.49,54.61
DISPL_A0  (via drill 0.5)
  Top 0.406: DISPLAY.38 38.92,66.67 85.72,66.67 90.17,62.23 v91.44,62.23
  Bottom 0.406: U$1.49 106.07,61.57 102.87,64.77 93.98,64.77 v91.44,62.23
DISPL_RST  (via drill 0.5)
  Top 0.406: DISPLAY.39 37.01,66.04 85.09,66.04 v90.17,60.96
  Bottom 0.406: U$1.48 103.74,61.36 101.6,63.5 93.98,63.5 91.44,60.96 v90.17,60.96
EEPROM_A0  (via drill 0.6)
  Top 0.406: IC5.5 142.67,46.56 144.78,44.45 144.78,22.86 v142.24,20.32 | v120.65,20.32 107.95,20.32 106.28,18.65 U$1.32
  Bottom 0.406: v120.65,20.32 v142.24,20.32
EEPROM_A05  (via drill 0.6)
  Top 0.406: IC3.1 124.46,44.68 124.46,45.72 128.27,49.53 v129.54,49.53 | v135.25,50.8 135.25,49.59 IC5.8
  Bottom 0.406: v129.54,49.53 133.35,49.53 134.62,50.8 v135.25,50.8
GND  (via drill 0.6)
  Top 0.61: 21.16,88.94 C3.- | v151.13,80.01 v151.13,74.93 | LED10.2 8.04,50.38 9.46,48.96 SPG-EXT.2 | DISPLAY.18 74.93,25.89 74.93,36.83 v71.12,40.64 74.93,40.64 77.47,43.18 77.47,49.53 76.2,50.8 v74.93,50.8 v71.12,54.61 | v27.94,52.07 23.1,52.07 GND.1 | v96.52,83.82 96.52,92.71 94.61,94.61 52.7,94.61 49.53,97.79 39.44,97.79 VCC-BUCHSE.2
  Top 0.813: C3.- 21.18,92.52 | 21.16,88.94 C2.- 17.78,88.94 17.78,82.66 | SR(5V).1 12.7,81.28 14.08,82.66 17.14,82.66 | LED10.2 LED11.2 8.04,63.92 8.89,64.77 15.88,64.77 17.14,66.04 17.14,82.66 | 17.14,82.66 17.78,82.66 | 17.78,82.66 20.15,82.66 C4.-
  Top 1.016: K1.6 22.86,92.71 22.84,92.7 21,92.7 | K1.6 22.9,92.75 | SR(3.3V).1 29.85,81.18 USB.3 32.59,87.2 33.02,87.63 33.02,93.98 | K1.6 23.58,94.66 24.31,95.39 26.74,95.39 USB.1 31.32,92.28 33.02,93.98 | 21,92.7 C1.- | 21.18,92.52 21,92.7 | 33.02,93.98 34.68,95.64 VCC-BUCHSE.2 39.09,95.64 VCC-BUCHSE.1
  Bottom 0.61: C10.2 153.75,38.95 C9.- 155.07,39.5 156.21,40.64 156.21,71.12 152.4,74.93 v151.13,74.93 149.86,73.66 144.78,73.66 144.78,73.81 D10.1 | SPG-EXT.3 SPG-EXT.2 14.26,48.96 R34.1 16.51,50.8 21.83,50.8 GND.1 23.1,52.07 | DISPLAY.18 DISPLAY.19 DISPLAY.20 | 104.14,83.82 104.14,85.09 105.41,86.36 | v27.94,52.07 31.75,52.07 34.29,49.53 | v71.12,40.64 71.12,42.06 D24.1 | v96.52,83.82 104.14,83.82 | v74.93,50.8 74.76,50.63 D25.1 74.44,49.53 69.85,49.53 | 129.54,73.81 D16.1 129.71,73.83 129.54,73.66 134.47,73.66 D14.1 134.79,73.83 134.62,73.66 139.55,73.66 D12.1 139.87,73.83 139.7,73.66 144.63,73.66 D10.1 | D10.1 144.95,73.83 | 104.14,83.82 104.14,82.3 105.16,81.28 105.41,81.28 | T5.2 110.56,81.21 110.49,81.28 | 105.41,81.28 105.48,81.21 T7.2 105.41,81.03 105.41,81.28 | 105.41,81.28 110.49,81.28 | T3.2 115.64,81.21 115.57,81.28 | 110.49,81.28 115.57,81.28 | 115.57,81.28 120.65,81.28 | T1.2 120.72,81.21 120.65,81.28 | 120.65,81.28 127,81.28 128.27,82.55 129.39,82.55 D17.1 129.54,82.7 129.54,82.55 134.62,82.55 | D15.1 134.79,82.72 134.62,82.55 | D13.1 139.87,82.72 139.7,82.55 | 134.62,82.55 139.7,82.55 | D11.1 144.95,82.72 144.78,82.55 | 139.7,82.55 144.78,82.55 | v151.13,80.01 148.59,82.55 144.78,82.55 | 34.29,49.53 38.88,49.53 | 38.88,49.53 D6.1 | D7.1 34.12,49.36 34.29,49.53 | D27.1 44.28,49.36 44.45,49.53 | 38.88,49.53 44.45,49.53 | 44.45,49.53 49.53,49.53 49.36,49.36 D26.1 49.68,49.53 54.61,49.53 | 54.61,49.53 54.44,49.36 D22.1 54.61,49.38 54.61,49.53 | D20.1 59.52,49.36 59.69,49.53 | 54.61,49.53 59.69,49.53 | D3.1 64.6,49.36 64.77,49.53 | 59.69,49.53 64.77,49.53 | D5.1 69.68,49.36 69.85,49.53
  Bottom 0.61: 64.77,49.53 69.85,49.53 | D4.1 70,54.61 v71.12,54.61 64.77,54.61 | 64.77,54.61 64.6,54.44 D2.1 64.77,54.46 64.77,54.61 | 59.69,54.61 59.52,54.44 D21.1 59.69,54.46 59.69,54.61 | 64.77,54.61 59.69,54.61 | D23.1 54.44,54.44 54.61,54.61 59.69,54.61 | T6.2 110.56,86.29 110.49,86.36 | 105.41,86.36 110.49,86.36 | 105.41,86.36 105.41,86.11 T8.2 | T4.2 115.64,86.29 115.57,86.36 | 110.49,86.36 115.57,86.36 | T2.2 120.72,86.29 120.65,86.36 115.57,86.36
IN0  (via drill 0.6)
  Top 0.406: U$1.26 121.52,11.03 120.65,10.16 107.95,10.16 93.98,24.13 93.98,39.37 v77.47,55.88 | R9.11 58.42,52.07 59.69,53.34 v60.96,53.34 v63.5,55.88
  Bottom 0.406: v60.96,53.34 D2.3 | v63.5,55.88 v77.47,55.88
IN1  (via drill 0.6)
  Top 0.406: U$1.27 118.98,12.3 118.11,11.43 107.95,11.43 95.25,24.13 95.25,40.64 93.98,41.91 v93.34,41.91 | R9.12 57.15,49.53 58.42,48.26 v60.96,48.26 D3.3 64.94,45.72 v67.31,45.72
  Bottom 0.406: v60.96,48.26 D3.3 | v93.34,41.91 88.9,41.91 83.82,36.83 72.39,36.83 67.31,41.91 v67.31,45.72
IN2  (via drill 0.6)
  Top 0.406: v66.04,53.34 63.56,53.34 R9.9 | U$1.33 103.53,20.93 99.06,25.4 99.06,41.27 v92.71,47.62
  Bottom 0.406: v66.04,53.34 D4.3 86.36,53.34 92.08,47.62 v92.71,47.62
IN3  (via drill 0.5, 0.6)
  Top 0.406: R9.10 59.69,49.85 60.33,49.21 63.5,49.21 64.45,48.26 v66.04,48.26 67.94,50.16 67.94,55.24 69.22,56.52 71.12,56.52 v73.03,54.61 | v89.53,55.24 88.9,55.88 v83.19,55.88 | v108.58,54.61 IC6.1
  Bottom 0.19: 102.87,55.22 104.78,55.22
  Bottom 0.406: v66.04,48.26 D5.3 | U$1.51 111.36,60.56 108.58,57.78 | 108.58,57.78 106.05,55.24 104.78,55.22 | v89.53,55.24 102.87,55.22 | v83.19,55.88 80.01,55.88 78.74,54.61 v73.03,54.61 | 108.58,57.78 v108.58,54.61
INP0
  Top 0.305: PFOSTENSTIFTE.13 52.07,40.64
  Top 0.406: 52.07,40.64 R9.1
INP1
  Top 0.305: R9.2 53.34,38.1 PFOSTENSTIFTE.14
INP2
  Top 0.305: PFOSTENSTIFTE.15 54.61,40.64
  Top 0.406: 54.61,40.64 R9.3
INP3
  Top 0.305: R9.4 55.88,38.1 PFOSTENSTIFTE.16
INP4
  Top 0.305: PFOSTENSTIFTE.17 57.15,40.64
  Top 0.406: 57.15,40.64 R9.5
INP5
  Top 0.305: R9.6 58.42,38.1 PFOSTENSTIFTE.18
INP6
  Top 0.305: PFOSTENSTIFTE.19 59.69,40.64
  Top 0.406: 59.69,40.64 R9.7
INP7
  Top 0.305: R9.8 60.96,38.1 PFOSTENSTIFTE.20
N$1
  Bottom 0.406: 31.6,30.3 R22.1
  Bottom 0.61: DISPLAY.1 31.6,30.3
N$2
  Top 0.406: S1.2 94.99,10 R42.1 96.94,8.47 99.06,6.35 R14.2
N$3
  Top 0.406: R42.2 96.52,3.81 95.25,2.54 LED12.1
N$4
  Bottom 0.406: 34.14,30.34 R23.1
  Bottom 0.61: DISPLAY.2 34.14,30.34
N$5
  Top 0.406: U$1.20 R50.2
N$6
  Top 0.406: R49.2 26.67,3.81 25.4,2.54 LED19.1
N$7
  Bottom 0.406: R24.1
  Bottom 0.61: DISPLAY.3 R24.1
N$8
  Top 0.406: R48.2 36.83,3.81 35.56,2.54 LED18.1
N$9
  Bottom 0.406: DISPLAY.31 54.46,65.66 C23.1
N$10
  Top 0.406: R47.2 46.99,3.81 45.72,2.54 LED17.1
N$11
  Top 0.813: LED11.1 R37.2
N$12
  Top 0.813: LED10.1 R38.2
N$13
  Top 0.406: R46.2 57.15,3.81 55.88,2.54 LED16.1
N$14
  Top 0.406: R45.2 66.04,3.81 64.77,2.54 LED15.1
N$15
  Top 0.406: R44.2 76.2,3.81 74.93,2.54 LED14.1
N$16
  Bottom 0.305: IC1.5 75.02,77.56 74.3,76.83 C14.1
N$17  (via drill 0.7)
  Top 1.016: D1.A 29.1,96.97 v30.18,95.88
  Bottom 1.016: v30.19,95.88 v30.18,95.88 36.42,89.64 VCC-BUCHSE.3
N$18
  Top 0.406: R43.2 86.36,3.81 85.09,2.54 LED13.1
N$19
  Top 0.406: R49.1 R21.2 22.19,9.31 S8.2
N$20
  Top 0.406: S7.2 32.19,9.31 R20.2 R48.1
N$21
  Top 0.406: S6.2 42.19,9.31 R19.2 R47.1
N$22
  Top 0.406: R46.1 R18.2 52.19,9.31 S5.2
N$23
  Bottom 0.406: DISPLAY.21 C22.1
N$24
  Bottom 0.406: DISPLAY.22 C21.1
N$25
  Bottom 0.406: DISPLAY.23 74.8,68.92 C20.1
N$26
  Bottom 0.406: DISPLAY.24 72.28,68.92 C19.1
N$27
  Bottom 0.406: LED1.A 95.35,21.27 R1.1
N$28
  Bottom 0.406: LED2.A 85.19,21.27 R2.1
N$29
  Bottom 0.406: LED3.A 75.03,21.27 R3.1
N$30
  Bottom 0.406: R4.1 61.82,21.59 LED4.A
N$31
  Bottom 0.406: LED5.A 54.71,21.27 R5.1
N$32
  Bottom 0.406: LED6.A 45.82,21.27 R6.1
N$33
  Bottom 0.406: LED7.A 32.07,21.27 33.02,20.32 R7.1
N$34
  Bottom 0.406: LED8.A 25.26,21.27 R8.1
N$35
  Bottom 0.406: DISPLAY.32 C17.1
N$36
  Bottom 0.406: DISPLAY.25 C18.1
N$37
  Bottom 0.406: DISPLAY.29 C24.1
N$38
  Bottom 0.406: C23.2 55.88,63.93 | 55.88,63.93 C24.2 | DISPLAY.30 57,65.05 55.88,63.93
N$39
  Bottom 0.406: C25.2 DISPLAY.27
N$40
  Bottom 0.406: C25.1 63.07,63.93 62.08,64.92 DISPLAY.28
N$41
  Top 0.406: 66.04,10.16 R45.1 | 66.04,10.16 R17.2 | S4.2 65.88,10 66.04,10.16
N$42
  Bottom 0.61: R34.2 15.81,47.05 16.51,46.35 19.09,46.35 R33.2 19.13,46.31 R32.2
N$43
  Top 0.406: R35.1 126.59,35.14 LED9.A
N$44
  Top 0.406: 76.2,10.16 R44.1 | 76.2,10.16 R16.2 | S3.2 76.04,10 76.2,10.16
N$45
  Top 0.406: 86.36,10.16 R15.2 | 86.36,10.16 R43.1 | 86.36,10.16 81.5,10.16 S2.2
N$46
  Top 0.406: U$1.21 R52.2
N$47
  Top 0.305: IC4.5 135.1,24.8 R50.1
N$48
  Top 0.305: R51.2 U$1.25
N$50
  Bottom 0.305: C15.2 71.75,80.01 72.39,80.64 76.2,80.64 76.97,79.88 IC1.2
N$51  (via drill 0.6)
  Top 0.61: v41.91,59.69 OP1.4
  Bottom 0.61: L2.2 C33-OP1.2 38.52,53.76 41.91,57.15 v41.91,59.69
N$53
  Top 0.406: U$1.22 R53.2
N$54
  Bottom 0.61: R61.2 123.83,26.04 125.4,24.46 S10.3
N$55  (via drill 0.6)
  Top 0.406: LED20.2 v139.7,39.37 | v139.7,42.55 139.7,43.18 138.86,44.02 IC5.12
  Bottom 0.406: v139.7,39.37 v139.7,42.55
N$56
  Top 0.406: IC5.2 142.67,42.75 143.51,41.91 143.51,38.95 LED21.2
N$57
  Top 0.406: R54.2 LED21.1
N$58
  Top 0.406: R25.2 LED20.1
N$59
  Top 0.406: IC5.9 IC5.6
N$61
  Top 0.406: IC5.11 IC5.4
OC0  (via drill 0.6)
  Top 0.305: IC4.12 133.8,31.3 133.99,31.11 140.34,31.11 v140.97,30.48
  Bottom 0.19: 144.17,34.9 147.98,34.9
  Bottom 0.305: v140.97,30.48 140.97,31.75 144.17,34.9 | 147.98,34.9 148.59,34.29
  Bottom 0.406: D-SUB-25.6 126.61,92.32 127.64,93.34 149.22,93.34 152.4,96.52 156.21,96.52 157.48,95.25 157.48,35.56 156.21,34.29 148.59,34.29
OC1  (via drill 0.6)
  Top 0.305: IC4.13 133.15,30.68 133.35,30.48 139.7,30.48 v140.97,29.21
  Bottom 0.19: 147.98,32.36 145.44,32.36
  Bottom 0.305: 145.44,32.36 142.24,29.21 v140.97,29.21 | 148.59,33.02 147.98,32.36
  Bottom 0.406: D-SUB-25.19 125.23,93.48 126.36,94.61 149.22,94.61 152.4,97.79 157.48,97.79 158.75,96.52 158.75,34.29 157.48,33.02 148.59,33.02
OUT+5V
  Top 1.016: SR(5V).TAB SR(5V).2 10.18,80.66 10.18,84.39 K1.14 10.88,86.98 12.86,88.96 14.73,88.96 C2.+
P1.0
  Top 0.406: R14.1 99.06,2.54 100.33,1.27 157.48,1.27 158.75,2.54 158.75,29.21 157.48,30.48 148.59,30.48 147.98,31.09 U$1.12
P1.1
  Top 0.406: R15.1 87.21,13.55 87.63,13.97 93.98,13.97 100.97,6.99 100.97,3.17 101.6,2.54 156.21,2.54 157.48,3.81 157.48,26.67 155.6,28.55 U$1.13
P1.2
  Top 0.406: R16.1 76.2,13.97 77.47,15.24 93.98,15.24 102.23,6.99 102.23,4.45 102.87,3.81 154.94,3.81 156.21,5.08 156.21,24.13 154.33,26.01 U$1.14
P1.3
  Top 0.406: R17.1 66.04,13.97 67.94,15.88 94.61,15.88 103.5,6.99 103.5,5.71 104.14,5.08 149.22,5.08 154.94,10.79 154.94,21.59 153.06,23.47 U$1.15
P1.4  (via drill 0.6)
  Top 0.406: C32.1 v57.15,12.7 R18.1
  Bottom 0.406: U$1.16 156.87,20.93 158.75,19.05 158.75,2.54 157.48,1.27 99.06,1.27 98.42,1.91 98.42,9.53 93.98,13.97 59.69,13.97 58.42,12.7 v57.15,12.7
P1.5  (via drill 0.6)
  Top 0.406: C31.1 v46.99,12.7 R19.1
  Bottom 0.406: v46.99,12.7 47.31,12.7 49.85,15.24 93.98,15.24 99.69,9.53 99.69,3.17 100.33,2.54 156.21,2.54 157.48,3.81 157.48,16.51 155.6,18.39 U$1.17
P1.6  (via drill 0.6)
  Top 0.406: v36.83,12.7 C30.1 R20.1
  Bottom 0.406: v36.83,12.7 38.1,12.7 41.91,16.51 93.98,16.51 100.97,9.53 100.97,4.45 101.6,3.81 154.94,3.81 156.21,5.08 156.21,15.24 154.94,16.51 143.51,16.51 141.84,18.18 U$1.18
P1.7  (via drill 0.6)
  Top 0.406: C29.1 v26.67,12.7 R21.1
  Bottom 0.406: v26.67,12.7 27.94,12.7 32.38,17.14 94.61,17.14 102.23,9.53 102.23,5.71 102.87,5.08 149.22,5.08 154.94,10.79 154.94,13.97 153.67,15.24 142.45,15.24 U$1.19
P3.2_PWM
  Top 0.406: R10.1 112.39,17.35 U$1.30
P4.0  (via drill 0.5)
  Top 0.19: 138.03,58.82 138.03,63.02
  Top 0.406: R26.16 140.44,78.74 147.32,78.74 148.59,77.47 v148.59,74.93 138.05,64.39 138.03,63.02 | 138.03,58.82 130.18,50.8 128.27,50.8 107.95,30.48 107.95,29.84 106.68,28.57 103.77,28.57 U$1.36
  Bottom 0.406: R1.2 97.37,22.18 U$1.36 | v148.59,74.93 D10.3
P4.1  (via drill 0.5)
  Top 0.19: 135.5,58.96 135.5,62.52
  Top 0.406: v148.59,83.82 146.05,83.82 144.78,82.55 140.97,82.55 138.74,80.32 R26.15 138.74,78.43 139.7,77.47 144.78,77.47 146.05,76.2 146.05,73.66 135.48,63.09 135.5,62.52 | U$1.37 106.02,31.09 128.27,53.34 129.54,53.34 135.15,58.95 135.5,58.96
  Bottom 0.406: v148.59,83.82 D11.3 | R2.2 88.9,21.59 91.44,24.13 96.52,24.13 103.48,31.09 U$1.37
P4.2  (via drill 0.5)
  Top 0.19: 132.94,60.33 132.94,62.69
  Top 0.406: R26.14 137.47,78.43 139.7,76.2 142.24,76.2 v143.51,74.93 143.51,73.19 132.94,62.69 | U$1.38 107.29,33.63 132.94,59.32 132.94,60.33
  Bottom 0.406: v143.51,74.93 D12.3 | R3.2 78.74,21.59 81.28,24.13 88.9,24.13 90.17,25.4 95.51,25.4 U$1.38
P4.3  (via drill 0.5)
  Top 0.19: 130.41,60.26 130.41,62.6
  Top 0.406: v143.51,83.82 140.34,83.82 139.06,82.55 137.16,82.55 136.2,81.59 R26.13 136.2,78.43 139.7,74.93 139.7,72.39 130.41,63.1 130.41,62.6 | U$1.39 108.56,36.17 130.42,58.03 130.41,60.26
  Bottom 0.406: v143.51,83.82 D13.3 | U$1.39 95.51,27.94 73.66,27.94 67.31,21.59 R4.2
P4.4  (via drill 0.5)
  Top 0.19: 127.87,60.28 127.87,62.68
  Top 0.406: R26.12 134.93,78.43 v138.43,74.93 138.43,72.39 129.54,63.5 128.69,63.5 127.87,62.68 | U$1.40 109.83,38.71 127.87,56.75 127.87,60.28
  Bottom 0.406: R5.2 58.42,21.59 60.96,24.13 68.58,24.13 73.66,29.21 94.24,29.21 U$1.40 | v138.43,74.93 D14.3
P4.5  (via drill 0.5)
  Top 0.19: 125.33,60.44 125.33,62.7
  Top 0.406: v138.43,83.82 135.89,83.82 133.66,81.59 R26.11 133.66,77.16 134.62,76.2 134.62,71.12 127,63.5 126.13,63.5 125.33,62.7 | U$1.41 111.1,41.25 125.33,55.48 125.33,60.44
  Bottom 0.406: v138.43,83.82 D15.3 | R6.2 49.53,21.59 53.34,25.4 68.58,25.4 73.66,30.48 92.97,30.48 U$1.41
P4.6  (via drill 0.5)
  Top 0.19: 122.79,60.39 122.79,62.45
  Top 0.406: R26.10 132.39,75.89 v133.35,74.93 133.35,72.97 123.4,63.02 122.79,62.45 | U$1.42 112.37,43.79 122.8,54.22 122.79,60.39
  Bottom 0.406: v133.35,74.93 D16.3 | U$1.42 91.7,31.75 73.66,31.75 68.58,26.67 44.45,26.67 38.1,20.32 R7.2
P4.7  (via drill 0.5)
  Top 0.19: 120.25,60.4 120.25,62.43
  Top 0.406: v133.35,83.82 133.35,82.55 131.12,80.32 R26.9 131.12,72.06 122.56,63.5 120.65,63.5 120.25,63.1 120.25,62.43 | U$1.43 113.64,46.33 120.25,52.94 120.25,60.4
  Bottom 0.406: v133.35,83.82 D17.3 | R8.2 28.59,21.6 29.84,22.86 39.37,22.86 44.45,27.94 68.58,27.94 73.66,33.02 90.43,33.02 U$1.43
PWR-5
  Top 0.813: SR(5V).3 7.62,86.36
  Top 1.016: K1.2 13.42,92.16 7.62,86.36 | K1.2 C1.+ | K1.2 13.42,96.73 13.64,96.95 15.47,96.95 D1.C
R1IN
  Bottom 0.305: IC1.13 75.67,89.04 RS232.3
R26.1
  Top 0.406: R26.1 140.01,88.63 D-SUB-25.1
R26.2
  Top 0.406: D-SUB-25.14 139.06,91.91 139.06,87 R26.2
R26.3
  Top 0.406: R26.3 137.47,88.86 D-SUB-25.2
R26.4
  Top 0.406: D-SUB-25.15 136.31,86.78 R26.4
R26.5
  Top 0.152: R26.5 134.62,87.63 134.62,88.9 D-SUB-25.3
  Top 0.406: R26.5 D-SUB-25.3
R26.6
  Top 0.406: D-SUB-25.16 133.54,86.79 R26.6
R26.7
  Top 0.406: R26.7 132.39,88.84 D-SUB-25.4
R26.8
  Top 0.406: D-SUB-25.17 130.77,87.02 R26.8
RX  (via drill 0.6)
  Top 0.305: v81.23,90.66 81.25,90.67
  Top 0.406: U$1.35 102.26,26.01 101.6,26.67 101.6,41.91 92.71,50.8 92.71,59.69 93.98,60.96 93.98,85.09 91.44,87.63 86.36,87.63 83.33,90.66 v81.23,90.66
  Bottom 0.305: IC1.12 75.02,85.1 75.02,87.84 74.48,88.38 74.48,89.68 75.46,90.66 v81.23,90.66
S10  (via drill 0.5)
  Top 0.406: S11.P2 51.22,88.47 C37.2 52.07,87.63 | R27.1 50.8,86.36 52.07,87.63 | 52.07,87.63 81.92,87.63 84.45,85.09 90.17,85.09 91.44,83.82 v91.44,63.5
  Bottom 0.406: U$1.58 129.14,62.63 127,64.77 104.14,64.77 102.87,66.04 93.98,66.04 v91.44,63.5
SCL  (via drill 0.6)
  Top 0.19: 117.71,60.37 117.71,62.49
  Top 0.305: IC5.13 133.56,42.75 132.93,42.13 IC3.6 129.12,42.13 128.91,41.91 128.91,40.64 134.45,35.09 IC4.11
  Top 0.406: D-SUB-25.18 126.57,93.34 106.05,93.34 104.14,91.44 104.14,72.39 109.4,67.13 IC2.14 115.75,67.13 116.84,66.04 116.84,63.5 117.71,62.49 | 128.91,41.91 v128.27,41.91 | v118.75,53.34 118.75,59.35 117.71,60.37
  Bottom 0.406: v118.75,53.34 128.27,43.81 v128.27,41.91
SCL_INT
  Bottom 0.406: R12.1 110.49,23.75 I2C.3 110.79,21.89 108.82,19.92 U$1.31
SDA  (via drill 0.5, 0.6)
  Top 0.19: 115.17,60.39 115.17,62.57
  Top 0.305: IC4.10 135.1,38.89 | IC3.5 133.13,40.86 v133.99,40.01 135.1,38.89 | IC5.1 140.54,41.48 137.95,38.89 135.1,38.89
  Top 0.406: D-SUB-25.5 129.54,89.24 129.54,92.71 127.64,94.61 106.05,94.61 102.87,91.44 102.87,72.39 109.4,65.86 IC2.15 113.21,65.86 115.18,63.89 115.17,62.57 | v117.47,52.07 117.47,58.05 115.17,60.39
  Bottom 0.406: v117.47,52.07 117.47,50.8 128.91,39.37 133.35,39.37 v133.99,40.01
SDA_INT
  Bottom 0.406: R11.1 113.33,27.42 I2C.2 113.33,21.29 113.9,20.72 U$1.29
SIMO  (via drill 0.5)
  Top 0.406: DISPLAY.36 41.76,69.7 43.18,71.12 49.53,71.12 50.8,72.39 79.38,72.39 v81.92,69.85 | IC6.5 111.74,49.53 105.62,49.53 U$1.45
  Bottom 0.406: U$1.45 SPI.5 91.47,51.41 81.92,60.96 v81.92,69.85
SOMI
  Top 0.406: SPI.4 96.6,53.95 R13.2 | IC6.2 104.34,53.35 U$1.46
  Bottom 0.406: SPI.4 U$1.46
SPI_CS
  Bottom 0.19: 102.42,57.76 104.96,57.76
  Bottom 0.406: SPI.2 100.99,59.03 102.42,57.76 | 104.96,57.76 105.03,57.78 U$1.50
STE
  Bottom 0.406: U$1.44 103.48,48.87 88.9,34.29 73.66,34.29 68.58,29.21 44.45,29.21 38.73,23.5 29.84,23.5 25.4,27.94 25.4,62.72 DISPLAY.40
T1  (via drill 0.6)
  Top 0.61: v124.46,80.01 124.46,86.36 123.84,86.98 D-SUB-25.7
  Bottom 0.61: T1.3 v124.46,80.01
T1OUT
  Bottom 0.305: IC1.14 76.32,85.1 76.32,88.02 77.38,89.08 RS232.2
T2  (via drill 0.6)
  Top 0.61: D-SUB-25.20 122.46,87.73 v122.56,87.63
  Bottom 0.61: v122.56,87.63 122.56,85.66 T2.3
T3  (via drill 0.6)
  Top 0.61: D-SUB-25.8 121.07,81.7 v119.38,80.01
  Bottom 0.61: T3.3 v119.38,80.01
T4  (via drill 0.6)
  Top 0.61: D-SUB-25.21 119.69,85.4 v119.38,85.09
  Bottom 0.61: T4.3 v119.38,85.09
T5  (via drill 0.6)
  Top 0.61: v114.3,80.01 115.57,80.01 118.3,82.74 D-SUB-25.9
  Bottom 0.61: T5.3 v114.3,80.01
T6  (via drill 0.6)
  Top 0.61: v114.3,85.09 115.57,85.09 116.92,86.44 D-SUB-25.22
  Bottom 0.61: T6.3 v114.3,85.09
T7  (via drill 0.6)
  Top 0.61: D-SUB-25.10 115.53,87.59 114.3,86.36 113.03,86.36 111.76,85.09 111.76,82.55 v109.22,80.01
  Bottom 0.61: T7.3 v109.22,80.01
T8  (via drill 0.6)
  Top 0.61: v109.22,85.09 109.22,86.36 110.49,87.63 113.67,87.63 114.15,88.11 D-SUB-25.23
  Bottom 0.61: T8.3 v109.22,85.09
TX  (via drill 0.6)
  Top 0.406: v83.82,87.63 85.09,86.36 90.17,86.36 92.71,83.82 92.71,60.96 91.44,59.69 91.44,50.8 100.33,41.91 100.33,25.4 102.26,23.47 U$1.34
  Bottom 0.406: IC1.11 74.36,85.11 74.36,86.86 73.95,87.27 72.27,87.27 71.41,88.13 71.41,89.8 72.82,91.21 72.82,93.16 73.95,94.29 81.52,94.29 82.65,93.16 82.65,88.8 v83.82,87.63
UCLK  (via drill 0.5)
  Top 0.406: DISPLAY.37 39.22,69.7 41.91,72.39 49.53,72.39 50.8,73.66 80.64,73.66 v83.19,71.12 | U$1.47 113.69,56.49 114.94,55.24 114.94,52.7 114.3,52.07 IC6.6
  Bottom 0.406: U$1.47 SPI.3 87.66,56.49 83.19,60.96 v83.19,71.12
USB  (via drill 0.9)
  Top 1.016: K1.1 10.16,92.68 8.89,91.44 v8.89,90.3
  Bottom 1.27: v8.89,90.3 9.45,89.74 USB.2
V-
  Bottom 0.305: 72.51,76.56 72.51,74.93 71.66,74.08 C16.2 | IC1.6 74.37,78.18 73.76,77.57 72.93,77.57 72.51,77.15 72.51,76.56 | 72.51,76.56
VCC-EEPROM
  Top 0.406: 129.54,44.67 129.32,44.67 | 129.54,44.67 IC3.8 130.03,45.42 C34.1 | R35.2 124.04,33.44 123.19,34.29 123.19,36.2 127,40.01 127,42.13 129.54,44.67
  Top 0.61: R35.2 124.46,27.94 125.4,27 S10.2
VOUTA  (via drill 0.5)
  Top 0.406: OP1.2 OP1.1 45.72,60.96 50.8,64.77 81.28,64.77 v84.45,61.59
  Bottom 0.406: v84.45,61.59 91.44,68.58 102.87,68.58 104.14,67.31 129.54,67.31 130.81,68.58 133.35,68.58 134.62,67.31 R28.2
VOUTB  (via drill 0.5)
  Top 0.406: OP1.7 OP1.6 39.37,64.14 40.64,65.41 84.45,65.41 v87.63,62.23
  Bottom 0.406: v87.63,62.23 92.71,67.31 102.87,67.31 104.14,66.04 131.87,66.04 R30.2
VOUTC  (via drill 0.6)
  Top 0.406: OP1.8 OP1.9 39.37,53.34 40.64,54.61 46.99,54.61 55.24,62.87 v66.67,62.87 | R39.2 130.81,11.43 127,7.62 107.95,7.62 91.44,24.13 91.44,38.1 v72.39,57.15
  Bottom 0.406: v66.67,62.87 v72.39,57.15
VOUTD  (via drill 0.6)
  Top 0.406: OP1.13 OP1.14 45.72,52.07 55.24,61.59 v69.85,61.59 | R41.2 125.73,12.7 121.92,8.89 107.95,8.89 92.71,24.13 92.71,38.73 v74.3,57.15
  Bottom 0.406: v69.85,61.59 v74.3,57.15
WP  (via drill 0.6)
  Top 0.406: v140.97,21.59 142.24,21.59 144.15,23.5 144.15,43.81 143.94,44.02 IC5.3
  Bottom 0.406: U$1.28 116.44,19.92 118.11,21.59 v140.97,21.59
WP5
  Top 0.406: IC3.7 132.3,43.4 133.35,44.45 133.35,45.72 134.19,46.56 IC5.10

## Text on the board
Top: 64 | 3V3 | +5V | 1 | 2 | 16 | G.CASCINO | BOCASboard | A.BODE | J.ROSKY | S8 | S7 | S6 | S5 | S4 | S3 | S2 | S1 | TOP
Bottom: | | + | | | 49 | 1 | GND | 3,3V | AGND | GND | GND | +5V | 1 | 2 | 32 | BOTTOM
tDocu: - | +